# EasyEDA schematic EASY-EDA-QUINN.json
TITLE: QUINN; REV: 3.0; Date: 2025-06-16; Sheet: 1/1; Drawn By: Keerthana S.; Company: Aldershot H.S.
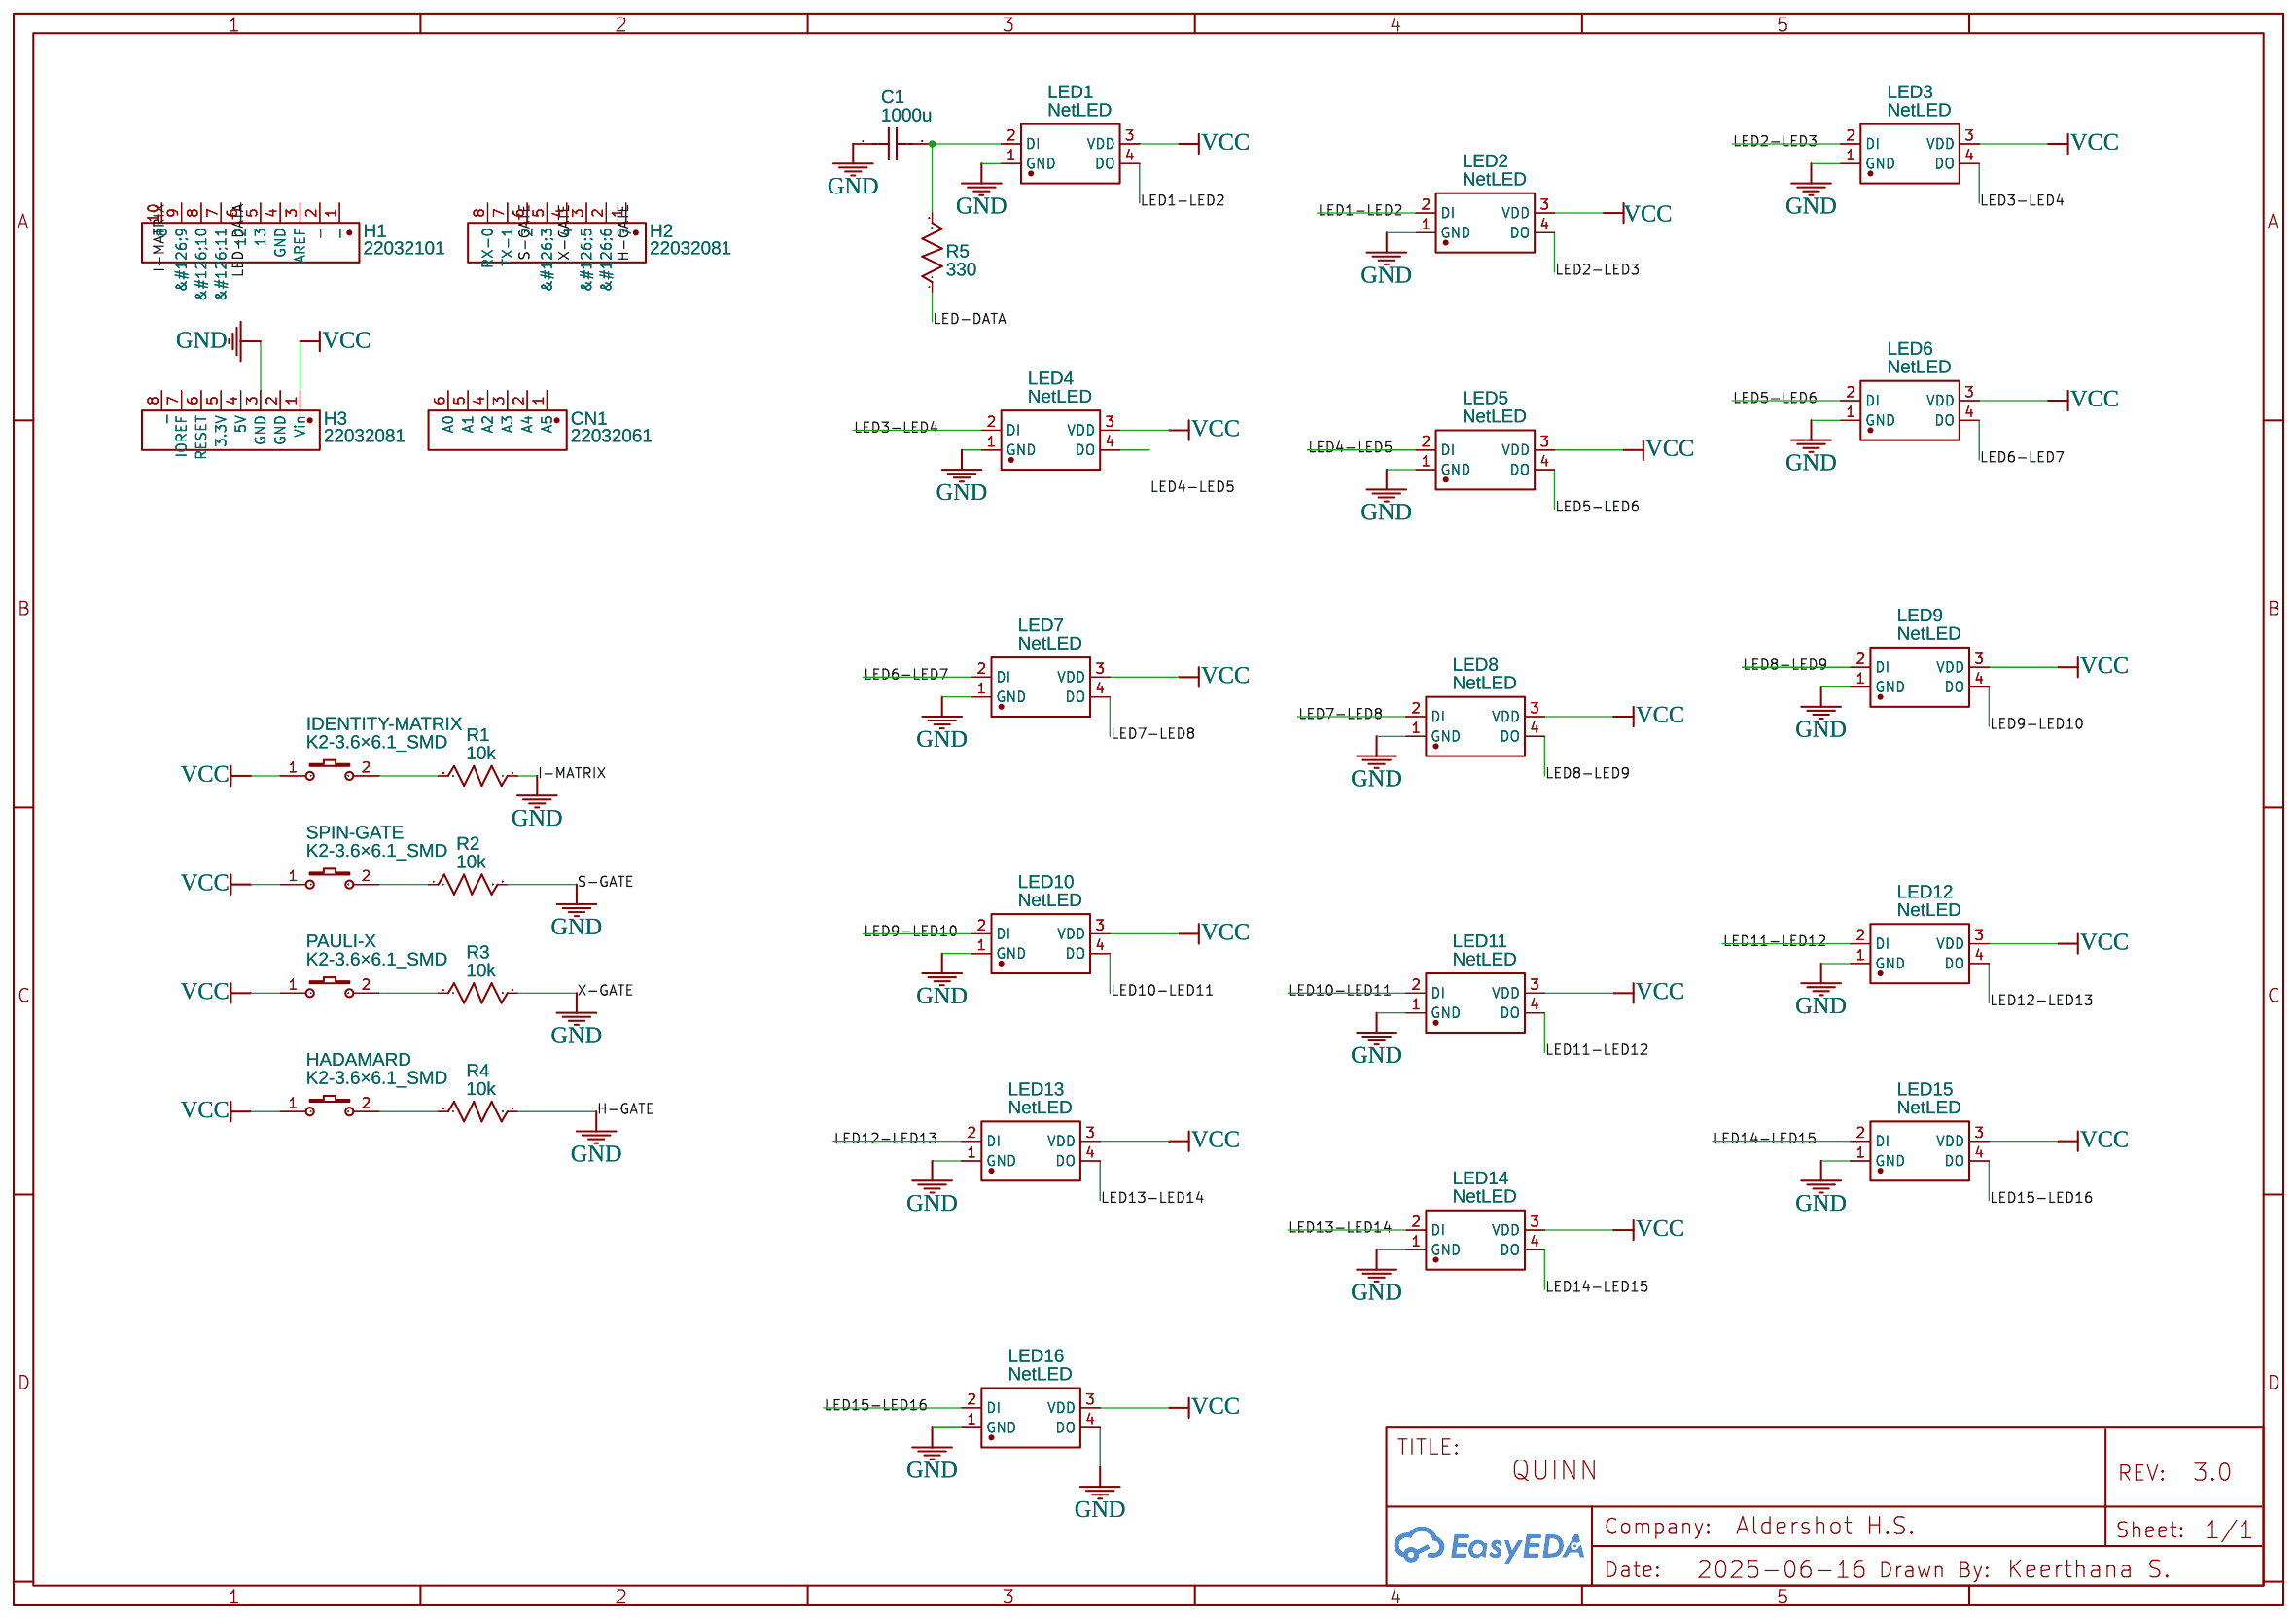
[diagram p0: schematic sheet]

## Parts
C1  1000u  [C0603]
CN1  22032061  [CONN-TH_6P-P2.54_22032061]
H1  22032101  [HDR-TH_10P-P2.54-V-M]
H2  22032081  [HDR-TH_8P-P2.54-V-M]
H3  22032081  [HDR-TH_8P-P2.54-V-M]
HADAMARD  K2-3.6×6.1_SMD  [KEY-SMD_2P-L6.2-W3.6-LS8.0]
IDENTITY-MATRIX  K2-3.6×6.1_SMD  [KEY-SMD_2P-L6.2-W3.6-LS8.0]
LED1  NetLED  [LED-SMD_4P-L3.2-W2.8-XL-6028RGBW-WS2812B]
LED2  NetLED  [LED-SMD_4P-L3.2-W2.8-XL-6028RGBW-WS2812B]
LED3  NetLED  [LED-SMD_4P-L3.2-W2.8-XL-6028RGBW-WS2812B]
LED4  NetLED  [LED-SMD_4P-L3.2-W2.8-XL-6028RGBW-WS2812B]
LED5  NetLED  [LED-SMD_4P-L3.2-W2.8-XL-6028RGBW-WS2812B]
LED6  NetLED  [LED-SMD_4P-L3.2-W2.8-XL-6028RGBW-WS2812B]
LED7  NetLED  [LED-SMD_4P-L3.2-W2.8-XL-6028RGBW-WS2812B]
LED8  NetLED  [LED-SMD_4P-L3.2-W2.8-XL-6028RGBW-WS2812B]
LED9  NetLED  [LED-SMD_4P-L3.2-W2.8-XL-6028RGBW-WS2812B]
LED10  NetLED  [LED-SMD_4P-L3.2-W2.8-XL-6028RGBW-WS2812B]
LED11  NetLED  [LED-SMD_4P-L3.2-W2.8-XL-6028RGBW-WS2812B]
LED12  NetLED  [LED-SMD_4P-L3.2-W2.8-XL-6028RGBW-WS2812B]
LED13  NetLED  [LED-SMD_4P-L3.2-W2.8-XL-6028RGBW-WS2812B]
LED14  NetLED  [LED-SMD_4P-L3.2-W2.8-XL-6028RGBW-WS2812B]
LED15  NetLED  [LED-SMD_4P-L3.2-W2.8-XL-6028RGBW-WS2812B]
LED16  NetLED  [LED-SMD_4P-L3.2-W2.8-XL-6028RGBW-WS2812B]
PAULI-X  K2-3.6×6.1_SMD  [KEY-SMD_2P-L6.2-W3.6-LS8.0]
R1  10k  [R0603]
R2  10k  [R0603]
R3  10k  [R0603]
R4  10k  [R0603]
R5  330  [R0603]
SPIN-GATE  K2-3.6×6.1_SMD  [KEY-SMD_2P-L6.2-W3.6-LS8.0]

## Library data of the parts
C1 = C_0603_US: Contributor: LCEDA_Lib
CN1 = 22032061: Contributor: LCSC; Supplier: LCSC; Supplier Part: C505159; Manufacturer: MOLEX; JLCPCB Part Class: Extended Part
H1 = 22032101: Contributor: LCSC; Supplier: LCSC; Supplier Part: C586972; Manufacturer: MOLEX; JLCPCB Part Class: Extended Part
H2 H3 = 22032081: Contributor: LCSC; Supplier: LCSC; Supplier Part: C586971; Manufacturer: MOLEX; JLCPCB Part Class: Extended Part
HADAMARD IDENTITY-MATRIX PAULI-X SPIN-GATE = K2-3.6×6.1_SMD: Supplier Part: C118141; Supplier: LCSC; Manufacturer Part: K2-1107ST-A4SW-06; Contributor: LCEDA_Lib; 制造商: 韩国韩荣
LED1-LED16 = XL-6028RGBW-WS2812B: Supplier: LCSC; Supplier Part: C42163197; Manufacturer: XINGLIGHT(成兴光); Contributor: lcsc; JLCPCB Part Class: Extended Part
R1-R5 = R_0603_US: Contributor: LCEDA_Lib

## Nets
GND: C1.1 H1.10(8) H2.1(7) H2.4 H2.6(2) H3.3(GND) LED1.1(GND) LED2.1(GND) LED3.1(GND) LED4.1(GND) LED5.1(GND) LED6.1(GND) LED7.1(GND) LED8.1(GND) LED9.1(GND) LED10.1(GND) LED11.1(GND) LED12.1(GND) LED13.1(GND) LED14.1(GND) LED15.1(GND) LED16.1(GND) LED16.4(DO) R1.1 R2.2 R3.2 R4.2
VCC: H3.1(Vin) HADAMARD.1 IDENTITY-MATRIX.1 LED1.3(VDD) LED2.3(VDD) LED3.3(VDD) LED4.3(VDD) LED5.3(VDD) LED6.3(VDD) LED7.3(VDD) LED8.3(VDD) LED9.3(VDD) LED10.3(VDD) LED11.3(VDD) LED12.3(VDD) LED13.3(VDD) LED14.3(VDD) LED15.3(VDD) LED16.3(VDD) PAULI-X.1 SPIN-GATE.1
LED1-LED2: LED1.4(DO) LED2.2(DI)
LED2-LED3: LED2.4(DO) LED3.2(DI)
LED3-LED4: LED3.4(DO) LED4.2(DI)
LED4-LED5: LED5.2(DI)
LED5-LED6: LED5.4(DO) LED6.2(DI)
LED6-LED7: LED6.4(DO) LED7.2(DI)
LED7-LED8: LED7.4(DO) LED8.2(DI)
LED8-LED9: LED8.4(DO) LED9.2(DI)
LED9-LED10: LED9.4(DO) LED10.2(DI)
LED10-LED11: LED10.4(DO) LED11.2(DI)
LED11-LED12: LED11.4(DO) LED12.2(DI)
LED12-LED13: LED12.4(DO) LED13.2(DI)
LED13-LED14: LED13.4(DO) LED14.2(DI)
LED14-LED15: LED14.4(DO) LED15.2(DI)
LED15-LED16: LED15.4(DO) LED16.2(DI)
LED-DATA: H1.6(12) R5.1
Net-(C1-2): C1.2 LED1.2(DI) R5.2
Net-(HADAMARD-2): HADAMARD.2 R4.1
Net-(IDENTITY-MATRIX-2): IDENTITY-MATRIX.2 R1.2
Net-(PAULI-X-2): PAULI-X.2 R3.1
Net-(R2-1): R2.1 SPIN-GATE.2

Not connected (* = marked no-connect by the designer): CN1 1(A5) 2(A4) 3(A3) 4(A2) 5(A1) 6(A0); H1 1(-) 2(-) 3(AREF) 4(GND) 5(13) 7(&#126;11) 8(&#126;10) 9(&#126;9); H2 2(&#126;6) 3(&#126;5) 5(&#126;3) 7(TX-1) 8(RX-0); H3 2(GND) 4(5V) 5(3.3V) 6(RESET) 7(IOREF) 8(_); LED4 4(DO)
